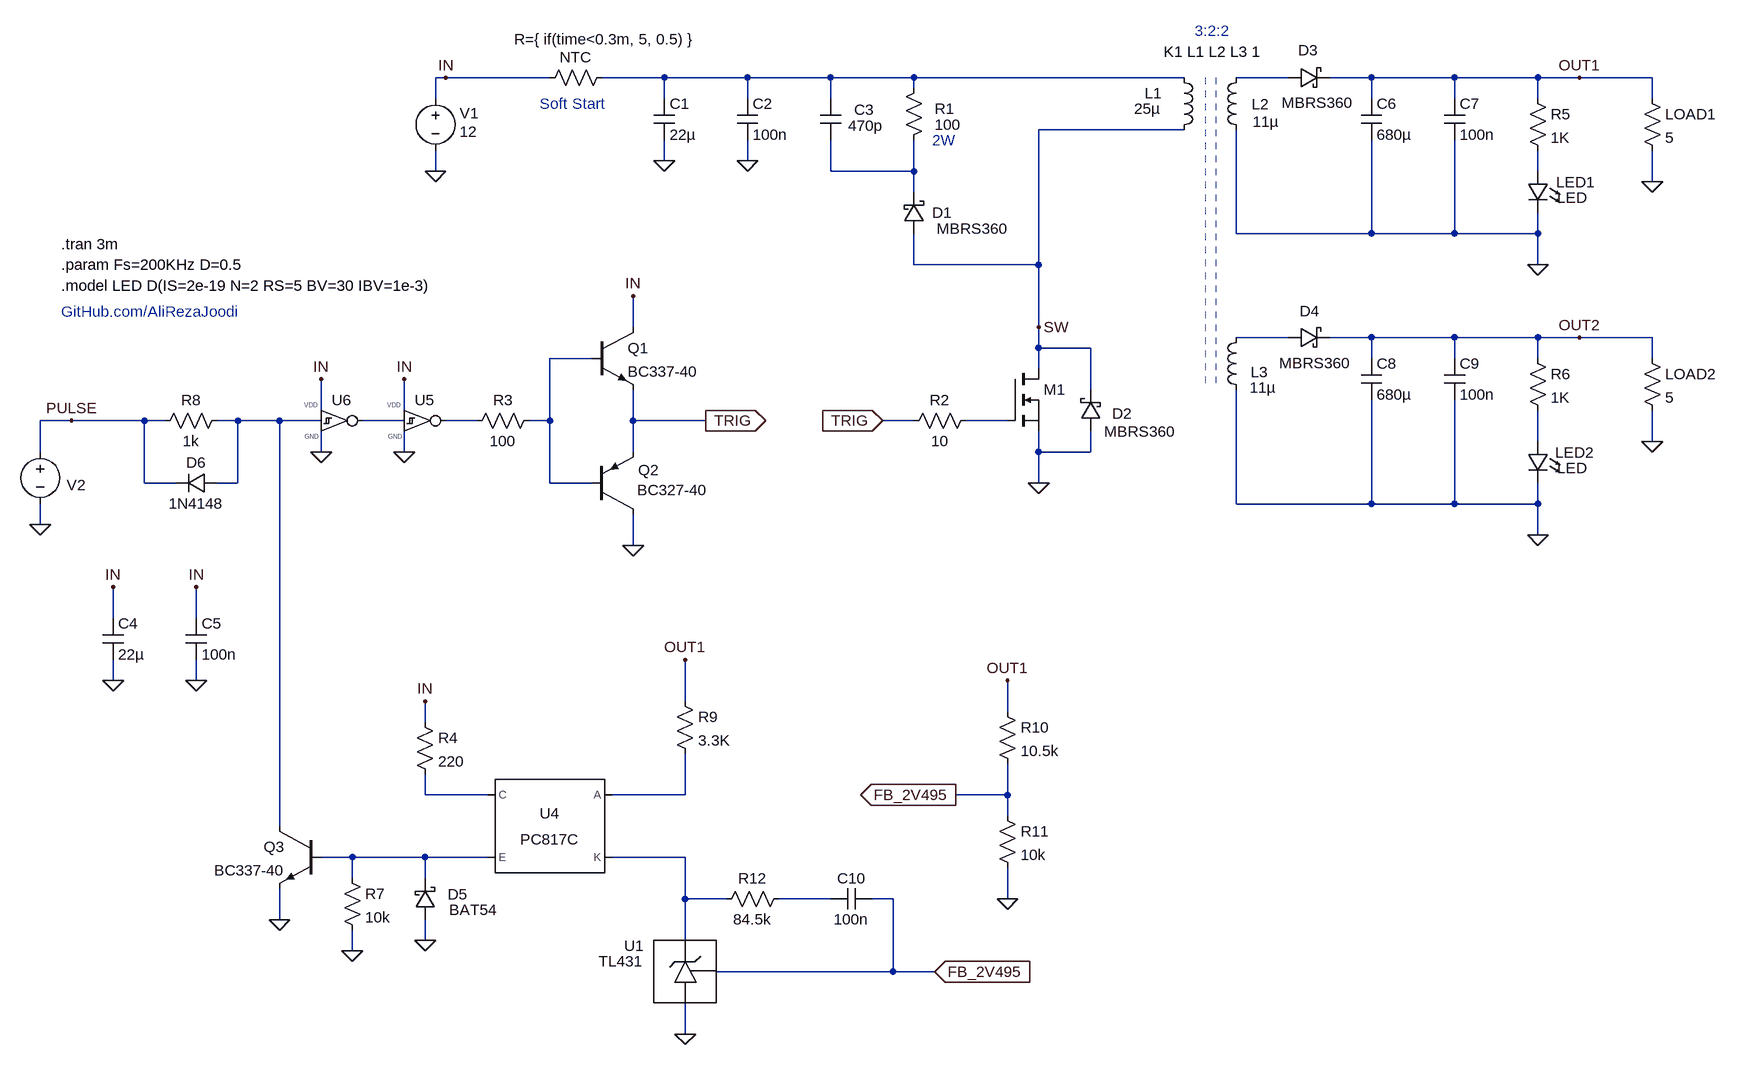
[diagram p0: schematic v2.0.asc]
v2.0.asc, the LTspice schematic file:
Version 4.1
SHEET 1 2620 1988
WIRE 304 192 288 192
WIRE 464 192 304 192
WIRE 640 192 544 192
WIRE 768 192 640 192
WIRE 896 192 768 192
WIRE 1024 192 896 192
WIRE 1440 192 1024 192
WIRE 1600 192 1520 192
WIRE 1728 192 1664 192
WIRE 1856 192 1728 192
WIRE 1984 192 1856 192
WIRE 2048 192 1984 192
WIRE 2160 192 2048 192
WIRE 1024 208 1024 192
WIRE 288 224 288 192
WIRE 640 224 640 192
WIRE 768 224 768 192
WIRE 896 224 896 192
WIRE 1728 224 1728 192
WIRE 1856 224 1856 192
WIRE 1984 224 1984 192
WIRE 2160 224 2160 192
WIRE 1440 272 1216 272
WIRE 640 320 640 288
WIRE 768 320 768 288
WIRE 288 336 288 304
WIRE 896 336 896 288
WIRE 1024 336 1024 288
WIRE 1024 336 896 336
WIRE 1984 336 1984 304
WIRE 2160 352 2160 304
WIRE 1024 368 1024 336
WIRE 1520 432 1520 272
WIRE 1728 432 1728 288
WIRE 1728 432 1520 432
WIRE 1856 432 1856 288
WIRE 1856 432 1728 432
WIRE 1984 432 1984 400
WIRE 1984 432 1856 432
WIRE 1024 480 1024 432
WIRE 1216 480 1216 272
WIRE 1216 480 1024 480
WIRE 1984 480 1984 432
WIRE 592 576 592 528
WIRE 1216 576 1216 480
WIRE 1600 592 1520 592
WIRE 1728 592 1664 592
WIRE 1856 592 1728 592
WIRE 1984 592 1856 592
WIRE 2048 592 1984 592
WIRE 2160 592 2048 592
WIRE 1216 608 1216 576
WIRE 1296 608 1216 608
WIRE 528 624 464 624
WIRE 1728 624 1728 592
WIRE 1856 624 1856 592
WIRE 1984 624 1984 592
WIRE 2160 624 2160 592
WIRE 1216 640 1216 608
WIRE 1296 672 1296 608
WIRE 112 704 112 656
WIRE 240 704 240 656
WIRE -272 720 -320 720
WIRE -160 720 -272 720
WIRE -128 720 -160 720
WIRE -16 720 -48 720
WIRE 48 720 -16 720
WIRE 112 720 48 720
WIRE 240 720 176 720
WIRE 352 720 304 720
WIRE 464 720 464 624
WIRE 464 720 432 720
WIRE 592 720 592 672
WIRE 704 720 592 720
WIRE 1024 720 976 720
WIRE 1168 720 1104 720
WIRE 1984 752 1984 704
WIRE 2160 752 2160 704
WIRE -320 768 -320 720
WIRE 112 768 112 736
WIRE 240 768 240 736
WIRE 592 768 592 720
WIRE 1216 768 1216 736
WIRE 1296 768 1296 736
WIRE 1296 768 1216 768
WIRE -160 816 -160 720
WIRE -112 816 -160 816
WIRE -16 816 -16 720
WIRE -16 816 -48 816
WIRE 464 816 464 720
WIRE 528 816 464 816
WIRE 1216 816 1216 768
WIRE 1520 848 1520 672
WIRE 1728 848 1728 688
WIRE 1728 848 1520 848
WIRE 1856 848 1856 688
WIRE 1856 848 1728 848
WIRE 1984 848 1984 816
WIRE 1984 848 1856 848
WIRE -320 880 -320 848
WIRE 1984 896 1984 848
WIRE 592 912 592 864
WIRE -208 1024 -208 976
WIRE -80 1024 -80 976
WIRE -208 1120 -208 1088
WIRE -80 1120 -80 1088
WIRE 672 1152 672 1088
WIRE 1168 1168 1168 1120
WIRE 272 1184 272 1152
WIRE 272 1296 272 1264
WIRE 368 1296 272 1296
WIRE 672 1296 672 1232
WIRE 672 1296 560 1296
WIRE 1168 1296 1168 1248
WIRE 1168 1296 1088 1296
WIRE 1168 1328 1168 1296
WIRE 48 1344 48 720
WIRE 160 1392 112 1392
WIRE 272 1392 160 1392
WIRE 368 1392 272 1392
WIRE 672 1392 560 1392
WIRE 160 1424 160 1392
WIRE 272 1424 272 1392
WIRE 672 1456 672 1392
WIRE 736 1456 672 1456
WIRE 896 1456 816 1456
WIRE 992 1456 960 1456
WIRE 1168 1456 1168 1408
WIRE 48 1488 48 1440
WIRE 272 1520 272 1488
WIRE 672 1520 672 1456
WIRE 160 1536 160 1504
WIRE 992 1568 992 1456
WIRE 992 1568 720 1568
WIRE 1056 1568 992 1568
WIRE 672 1664 672 1616
FLAG 288 336 0
FLAG -320 880 0
FLAG -272 720 PULSE
FLAG 1216 816 0
FLAG 640 320 0
FLAG 768 320 0
FLAG 1984 896 0
FLAG 2048 592 OUT2
FLAG 304 192 IN
FLAG 592 528 IN
FLAG 592 912 0
FLAG 112 768 0
FLAG 112 656 IN
FLAG 240 768 0
FLAG 240 656 IN
FLAG 48 1488 0
FLAG 272 1152 IN
FLAG -208 976 IN
FLAG -208 1120 0
FLAG -80 1120 0
FLAG 1984 480 0
FLAG 2048 192 OUT1
FLAG -80 976 IN
FLAG 2160 752 0
FLAG 2160 352 0
FLAG 1216 576 SW
FLAG 672 1664 0
FLAG 1168 1456 0
FLAG 1168 1120 OUT1
FLAG 160 1536 0
FLAG 976 720 TRIG
IOPIN 976 720 In
FLAG 704 720 TRIG
IOPIN 704 720 Out
FLAG 272 1520 0
FLAG 672 1088 OUT1
FLAG 1056 1568 FB_2V495
IOPIN 1056 1568 In
FLAG 1088 1296 FB_2V495
IOPIN 1088 1296 Out
SYMBOL voltage 288 208 R0
WINDOW 123 0 0 Left 0
WINDOW 39 24 105 Left 2
WINDOW 0 37 39 Left 2
WINDOW 3 37 67 Left 2
SYMATTR InstName V1
SYMATTR Value 12
SYMBOL voltage -320 752 R0
WINDOW 123 0 0 Left 0
WINDOW 39 0 0 Left 0
WINDOW 0 41 67 Left 2
WINDOW 3 -361 80 Invisible 2
SYMATTR InstName V2
SYMATTR Value PULSE(0 9 0 {0.01/Fs} {0.01/Fs} {D/Fs} {1/Fs})
SYMBOL ind 1424 176 R0
WINDOW 0 -45 40 Left 2
WINDOW 3 -61 64 Left 2
SYMATTR InstName L1
SYMATTR Value 25µ
SYMATTR SpiceLine Rser=0.057
SYMATTR Type ind
SYMBOL cap 880 288 M180
WINDOW 0 52 47 Left 2
WINDOW 3 43 22 Left 2
SYMATTR InstName C3
SYMATTR Value 470p
SYMBOL res 1008 304 M180
WINDOW 0 48 64 Left 2
WINDOW 3 48 40 Left 2
SYMATTR InstName R1
SYMATTR Value 100
SYMATTR SpiceLine pwr=2
SYMBOL nmos 1168 640 R0
WINDOW 3 56 72 Invisible 2
SYMATTR Value BSC100N06LS3
SYMATTR InstName M1
SYMBOL cap 624 224 R0
SYMATTR InstName C1
SYMATTR Value 22µ
SYMBOL schottky 1008 432 M180
WINDOW 0 44 32 Left 2
WINDOW 3 161 8 Right 2
SYMATTR InstName D1
SYMATTR Value MBRS360
SYMBOL cap 752 224 R0
SYMATTR InstName C2
SYMATTR Value 100n
SYMBOL schottky 1312 736 R180
WINDOW 0 -48 27 Left 2
WINDOW 3 -114 -1 Left 2
SYMATTR InstName D2
SYMATTR Value MBRS360
SYMBOL ind 1536 688 R180
WINDOW 0 -33 43 Left 2
WINDOW 3 -45 19 Left 2
SYMATTR InstName L3
SYMATTR Value 11µ
SYMATTR SpiceLine Rser=0.011
SYMATTR Type ind
SYMBOL schottky 1600 608 R270
WINDOW 0 41 33 VTop 2
WINDOW 3 -8 41 VBottom 2
SYMATTR InstName D4
SYMATTR Value MBRS360
SYMBOL cap 1712 624 R0
SYMATTR InstName C8
SYMATTR Value 680µ
SYMBOL cap 1840 624 R0
SYMATTR InstName C9
SYMATTR Value 100n
SYMBOL res 1968 608 R0
SYMATTR InstName R6
SYMATTR Value 1K
SYMBOL npn 528 576 R0
SYMATTR InstName Q1
SYMATTR Value BC337-40
SYMBOL pnp 528 864 M180
WINDOW 0 72 68 Left 2
WINDOW 3 70 37 Left 2
SYMATTR InstName Q2
SYMATTR Value BC327-40
SYMBOL res 1008 736 R270
WINDOW 0 32 56 VTop 2
WINDOW 3 0 56 VBottom 2
SYMATTR InstName R2
SYMATTR Value 10
SYMBOL res 336 736 R270
WINDOW 0 32 56 VTop 2
WINDOW 3 0 56 VBottom 2
SYMATTR InstName R3
SYMATTR Value 100
SYMBOL res -144 736 R270
WINDOW 0 32 56 VTop 2
WINDOW 3 0 56 VBottom 2
SYMATTR InstName R8
SYMATTR Value 1k
SYMBOL diode -48 800 R90
WINDOW 0 0 32 VBottom 2
WINDOW 3 32 32 VTop 2
SYMATTR InstName D6
SYMATTR Value 1N4148
SYMBOL npn 112 1344 M0
SYMATTR InstName Q3
SYMATTR Value BC337-40
SYMBOL res 256 1168 R0
SYMATTR InstName R4
SYMATTR Value 220
SYMBOL Optos\\PC817C 464 1344 M0
SYMATTR InstName U4
SYMBOL cap -224 1024 R0
SYMATTR InstName C4
SYMATTR Value 22µ
SYMBOL cap -96 1024 R0
SYMATTR InstName C5
SYMATTR Value 100n
SYMBOL ind 1536 288 R180
WINDOW 0 -35 55 Left 2
WINDOW 3 -9 28 Right 2
SYMATTR InstName L2
SYMATTR Value 11µ
SYMATTR SpiceLine Rser=0.011
SYMATTR Type ind
SYMBOL schottky 1600 208 R270
WINDOW 0 43 31 VTop 2
WINDOW 3 -7 45 VBottom 2
SYMATTR InstName D3
SYMATTR Value MBRS360
SYMBOL cap 1712 224 R0
SYMATTR InstName C6
SYMATTR Value 680µ
SYMBOL cap 1840 224 R0
SYMATTR InstName C7
SYMATTR Value 100n
SYMBOL res 1968 208 R0
SYMATTR InstName R5
SYMATTR Value 1K
SYMBOL res 448 208 R270
WINDOW 0 32 56 VTop 2
WINDOW 3 91 100 VBottom 2
SYMATTR InstName NTC
SYMATTR Value R={ if(time<0.3m, 5, 0.5) }
SYMBOL MyLib\\Digital\\CD40106B 240 688 R0
WINDOW 38 16 64 Invisible 2
SYMATTR InstName U5
SYMATTR SpiceLine vdd=12
SYMBOL MyLib\\Digital\\CD40106B 112 688 R0
WINDOW 38 16 64 Invisible 2
SYMATTR InstName U6
SYMATTR SpiceLine vdd=12
SYMBOL LED 2000 336 M0
WINDOW 0 -72 17 Left 2
WINDOW 3 -60 41 Left 2
SYMATTR InstName LED1
SYMATTR Value LED
SYMBOL LED 2000 752 M0
WINDOW 0 -71 17 Left 2
WINDOW 3 -60 41 Left 2
SYMATTR InstName LED2
SYMATTR Value LED
SYMBOL res 2144 608 R0
SYMATTR InstName LOAD2
SYMATTR Value 5
SYMBOL res 2144 208 R0
SYMATTR InstName LOAD1
SYMATTR Value 5
SYMBOL MyLib\\Regulator_Linear\\TL431 672 1568 M0
SYMATTR InstName U1
SYMBOL res 1152 1152 R0
SYMATTR InstName R10
SYMATTR Value 10.5k
SYMBOL res 1152 1312 R0
SYMATTR InstName R11
SYMATTR Value 10k
SYMBOL res 144 1408 R0
SYMATTR InstName R7
SYMATTR Value 10k
SYMBOL cap 896 1440 M90
WINDOW 0 0 32 VBottom 2
WINDOW 3 32 32 VTop 2
SYMATTR InstName C10
SYMATTR Value 100n
SYMBOL res 832 1440 R90
WINDOW 0 0 56 VBottom 2
WINDOW 3 32 56 VTop 2
SYMATTR InstName R12
SYMATTR Value 84.5k
SYMBOL schottky 256 1488 M180
WINDOW 0 51 39 Left 2
WINDOW 3 53 15 Left 2
SYMATTR InstName D5
SYMATTR Value BAT54
SYMBOL res 656 1136 R0
SYMATTR InstName R9
SYMATTR Value 3.3K
TEXT -288 448 Left 2 !.tran 3m
TEXT 1408 152 Left 2 !K1 L1 L2 L3 1
TEXT -288 480 Left 2 !.param Fs=200KHz D=0.5
TEXT 448 232 Left 2 ;Soft Start
TEXT -288 512 Left 2 !.model LED D(IS=2e-19 N=2 RS=5 BV=30 IBV=1e-3)
TEXT -288 552 Left 2 ;GitHub.com/AliRezaJoodi
TEXT 1088 288 Right 2 ;2W
TEXT 1456 120 Left 2 ;3:2:2
LINE Normal 1488 192 1488 672 2
LINE Normal 1472 192 1472 672 2

The netlist it stands for:
* v2.0.asc
V1 IN 0 12
V2 PULSE 0 PULSE(0 9 0 {0.01/Fs} {0.01/Fs} {D/Fs} {1/Fs})
L1 N001 SW 25µ Rser=0.057
C3 N003 N001 470p
R1 N003 N001 100 pwr=2
M1 SW N010 0 0 BSC100N06LS3
C1 N001 0 22µ
D1 SW N003 MBRS360
C2 N001 0 100n
D2 0 SW MBRS360
L3 0 N005 11µ Rser=0.011
D4 N005 OUT2 MBRS360
C8 OUT2 0 680µ
C9 OUT2 0 100n
R6 OUT2 N011 1K
Q1 IN N006 TRIG 0 BC337-40
Q2 0 N006 TRIG 0 BC327-40
R2 TRIG N010 10
R3 N009 N006 100
R8 PULSE N007 1k
D6 N007 PULSE 1N4148
Q3 N007 N014 0 0 BC337-40
R4 IN N012 220
X§U4 N013 N015 N012 N014 PC817 Igain=2.3m  ; PC817C, pins A K C E
C4 IN 0 22µ
C5 IN 0 100n
L2 0 N002 11µ Rser=0.011
D3 N002 OUT1 MBRS360
C6 OUT1 0 680µ
C7 OUT1 0 100n
R5 OUT1 N004 1K
R§NTC IN N001 R={ if(time<0.3m, 5, 0.5) }
X§U5 N008 N009 IN 0 CD40106B vdd=12 speed=2 tripdt=100n  ; pins in out VDD GND
X§U6 N007 N008 IN 0 CD40106B vdd=12 speed=2 tripdt=100n  ; pins in out VDD GND
D§LED1 N004 0 LED
D§LED2 N011 0 LED
R§LOAD2 OUT2 0 5
R§LOAD1 OUT1 0 5
X§U1 N015 0 FB_2V495 TL431  ; pins CATHODE ANODE REF
R10 OUT1 FB_2V495 10.5k
R11 FB_2V495 0 10k
R7 N014 0 10k
C10 N016 FB_2V495 100n
R12 N016 N015 84.5k
D5 0 N014 BAT54
R9 OUT1 N013 3.3K
.model D D
.lib standard.dio
.model NPN NPN
.model PNP PNP
.lib standard.bjt
.model NMOS NMOS
.model PMOS PMOS
.lib standard.mos
.tran 3m
K1 L1 L2 L3 1
.param Fs=200KHz D=0.5
* Soft Start
.model LED D(IS=2e-19 N=2 RS=5 BV=30 IBV=1e-3)
* GitHub.com/AliRezaJoodi
* 2W
* 3:2:2
.lib PC817.sub
.lib MyLib/Digital/_CD4xxx.lib
.lib MyLib/Regulator_Linear/TL431.lib
.backanno
.end